# Altium schematic sheet Sensors.SchDoc
size A1; SheetNumber: 4; SheetTotal: 4
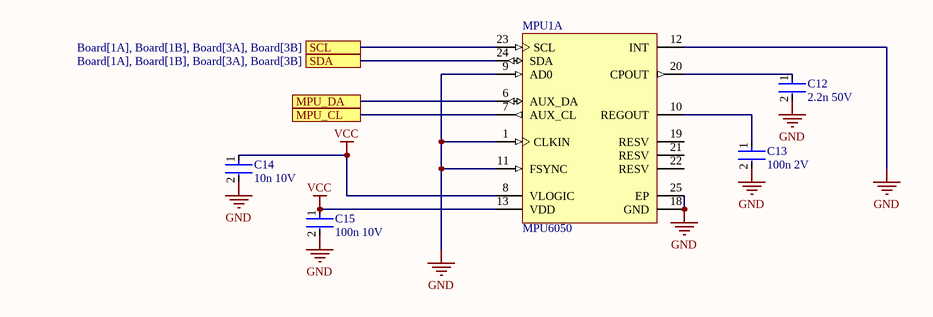
[diagram p0: Sensors.SchDoc]

## Parts
C12  2.2n 50V  [FP-GRM155-0_05-MFG]
C13  100n 2V  [FP-GRM155-0_05-MFG]
C14  10n 10V  [FP-GRM155-0_05-MFG]
C15  100n 10V  [FP-GRM155-0_05-MFG]
MPU1  MPU6050  [INSE-QFN-24_V]  (part A of 2)

## Ports
MPU_CL, MPU_DA, SCL (see Board[1A], Board[1B], Board[3A], Board[3B]), SDA (see Board[1A], Board[1B], Board[3A], Board[3B])

## Nets
GND: C12.2 C13.2 C14.2 C15.2 MPU1.1(CLKIN) MPU1.9(AD0) MPU1.11(FSYNC) MPU1.12(INT) MPU1.18(GND) MPU1.25(EP)
VCC: C14.1 C15.1 MPU1.8(VLOGIC) MPU1.13(VDD)
MPU_CL: MPU1.7(AUX_CL) ; port MPU_CL
MPU_DA: MPU1.6(AUX_DA) ; port MPU_DA
SCL: MPU1.23(SCL) ; port SCL
SDA: MPU1.24(SDA) ; port SDA
NetC12_1: C12.1 MPU1.20(CPOUT)
NetC13_1: C13.1 MPU1.10(REGOUT)

Not connected (* = marked no-connect by the designer): MPU1 19(RESV) 21(RESV) 22(RESV)

## Library data of the parts
C12-C15 = CMP-2008-04345-2: Chip Multilayer Ceramic Capacitors for General Purpose, 0402, 390pF, C0G, 30ppm/°C, 5%, 50V; REACH SVHC: No SVHC; Case Code (Metric): 1005; Thickness: 0.022inch; Lead Free: Lead Free; Case/Package: 0402; Min Operating Temperature: -55°C; Mount: Surface Mount; Length: 1mm; Depth: 0.5mm; Package Quantity: 1; Tolerance: 5%; Case Code (Imperial): 0402; Temperature Coefficient: 30ppm/°C; Packaging: Tape and Reel; Voltage Rating (DC): 50V; Material: Ceramic; Voltage Rating: 50V; Max Operating Temperature: 125°C; Voltage: 50V; Radiation Hardening: No; Capacitance: 390pF; Termination: SMD/SMT; Height: 0.5mm; Dielectric: C0G; Width: 0.02inch
MPU1 = CMP-010-00014-3: 3-Axis Gyroscope, 3-Axis Accelerometer, 2.375 to 3.46 V, -40 to 105 degC, 24-Pin QFN, RoHS, Tape and Reel; Manufacturer: InvenSense; Max Supply Voltage: 3.6V; Min Supply Voltage: 2.5V; Sensor Type: Motion; Interface: I2C; Min Operating Temperature: -40°C; Case/Package: QFN; Package Quantity: 5000; Pins: 24; RoHS Compliant: True; Packaging: CutTape; Datasheet URL: https://datasheet.ciiva.com/1513/1788002-1513632.pdf; Package Reference: QFN-24; Datasheet Version: Rev. 3.4, 08/2013; Package Description: 24-Pin Quad Flat No-lead Package, Body 4 x 4 mm, Pitch 0.5 mm; Max Operating Temperature: 85°C; Mounting Technology: SM